# EAGLE schematic OSSI-1 LED Panel (EAGLE 6.5.0)
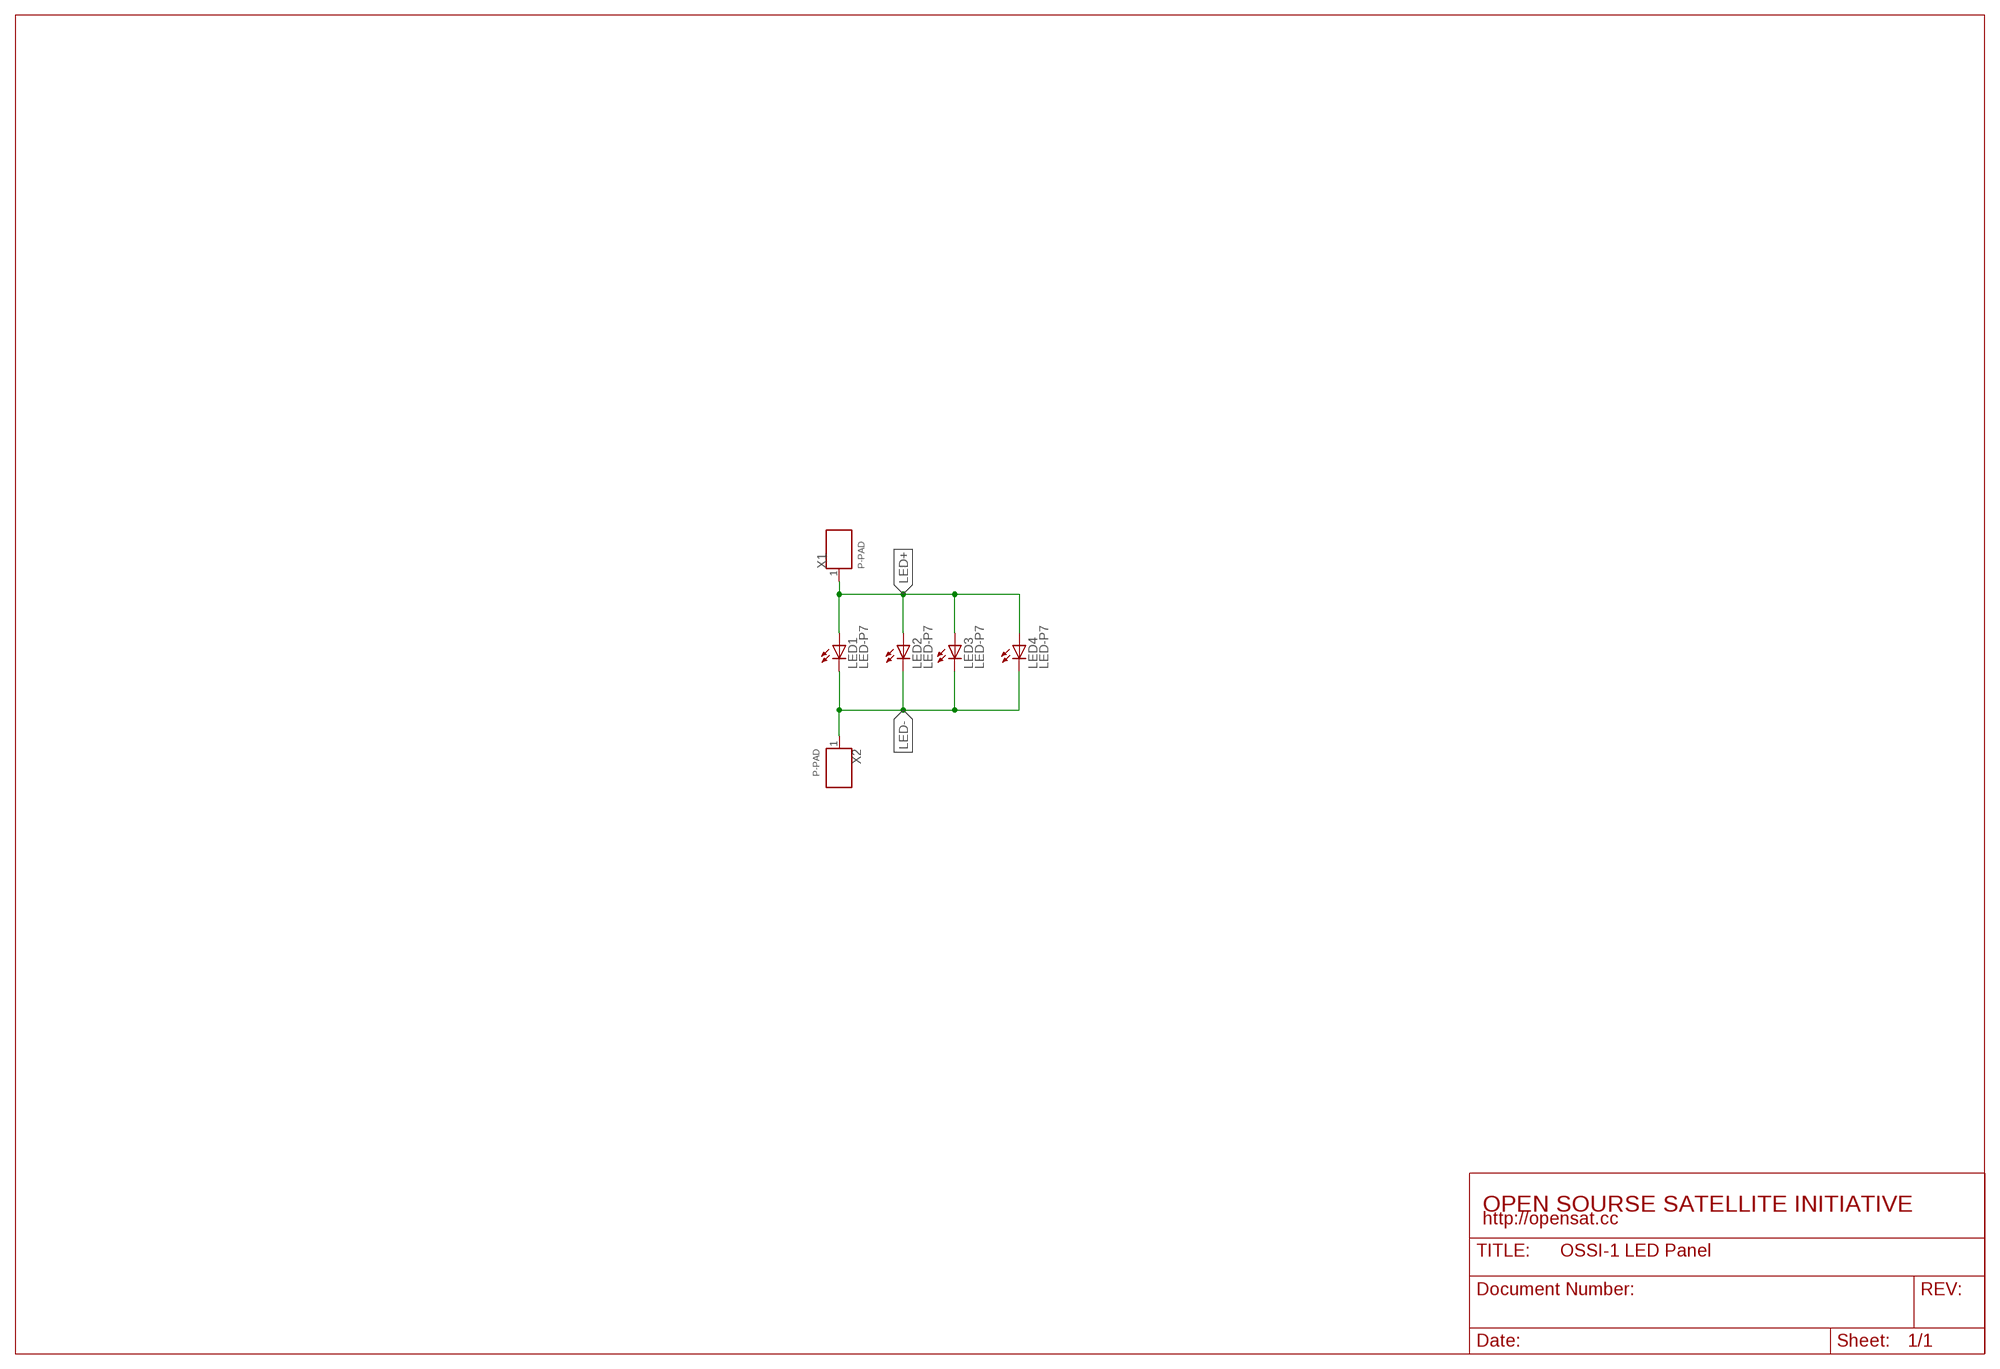
[diagram p0: schematic, sheet 1]

## Parts
LED1  LED-P7  [P7]
LED2  LED-P7  [P7]
LED3  LED-P7  [P7]
LED4  LED-P7  [P7]
X1  P-PAD  [P-PAD]
X2  P-PAD  [P-PAD]

## Nets
LED+: LED1.A LED2.A LED3.A LED4.A X1.1
LED-: LED1.C LED2.C LED3.C LED4.C X2.1

## Notes on the sheet
- OPEN SOURSE SATELLITE INITIATIVE
- http://opensat.cc

## Library data of the parts
LED1-LED4 = OSSI:LED
X1 X2 = OSSI:P-PAD